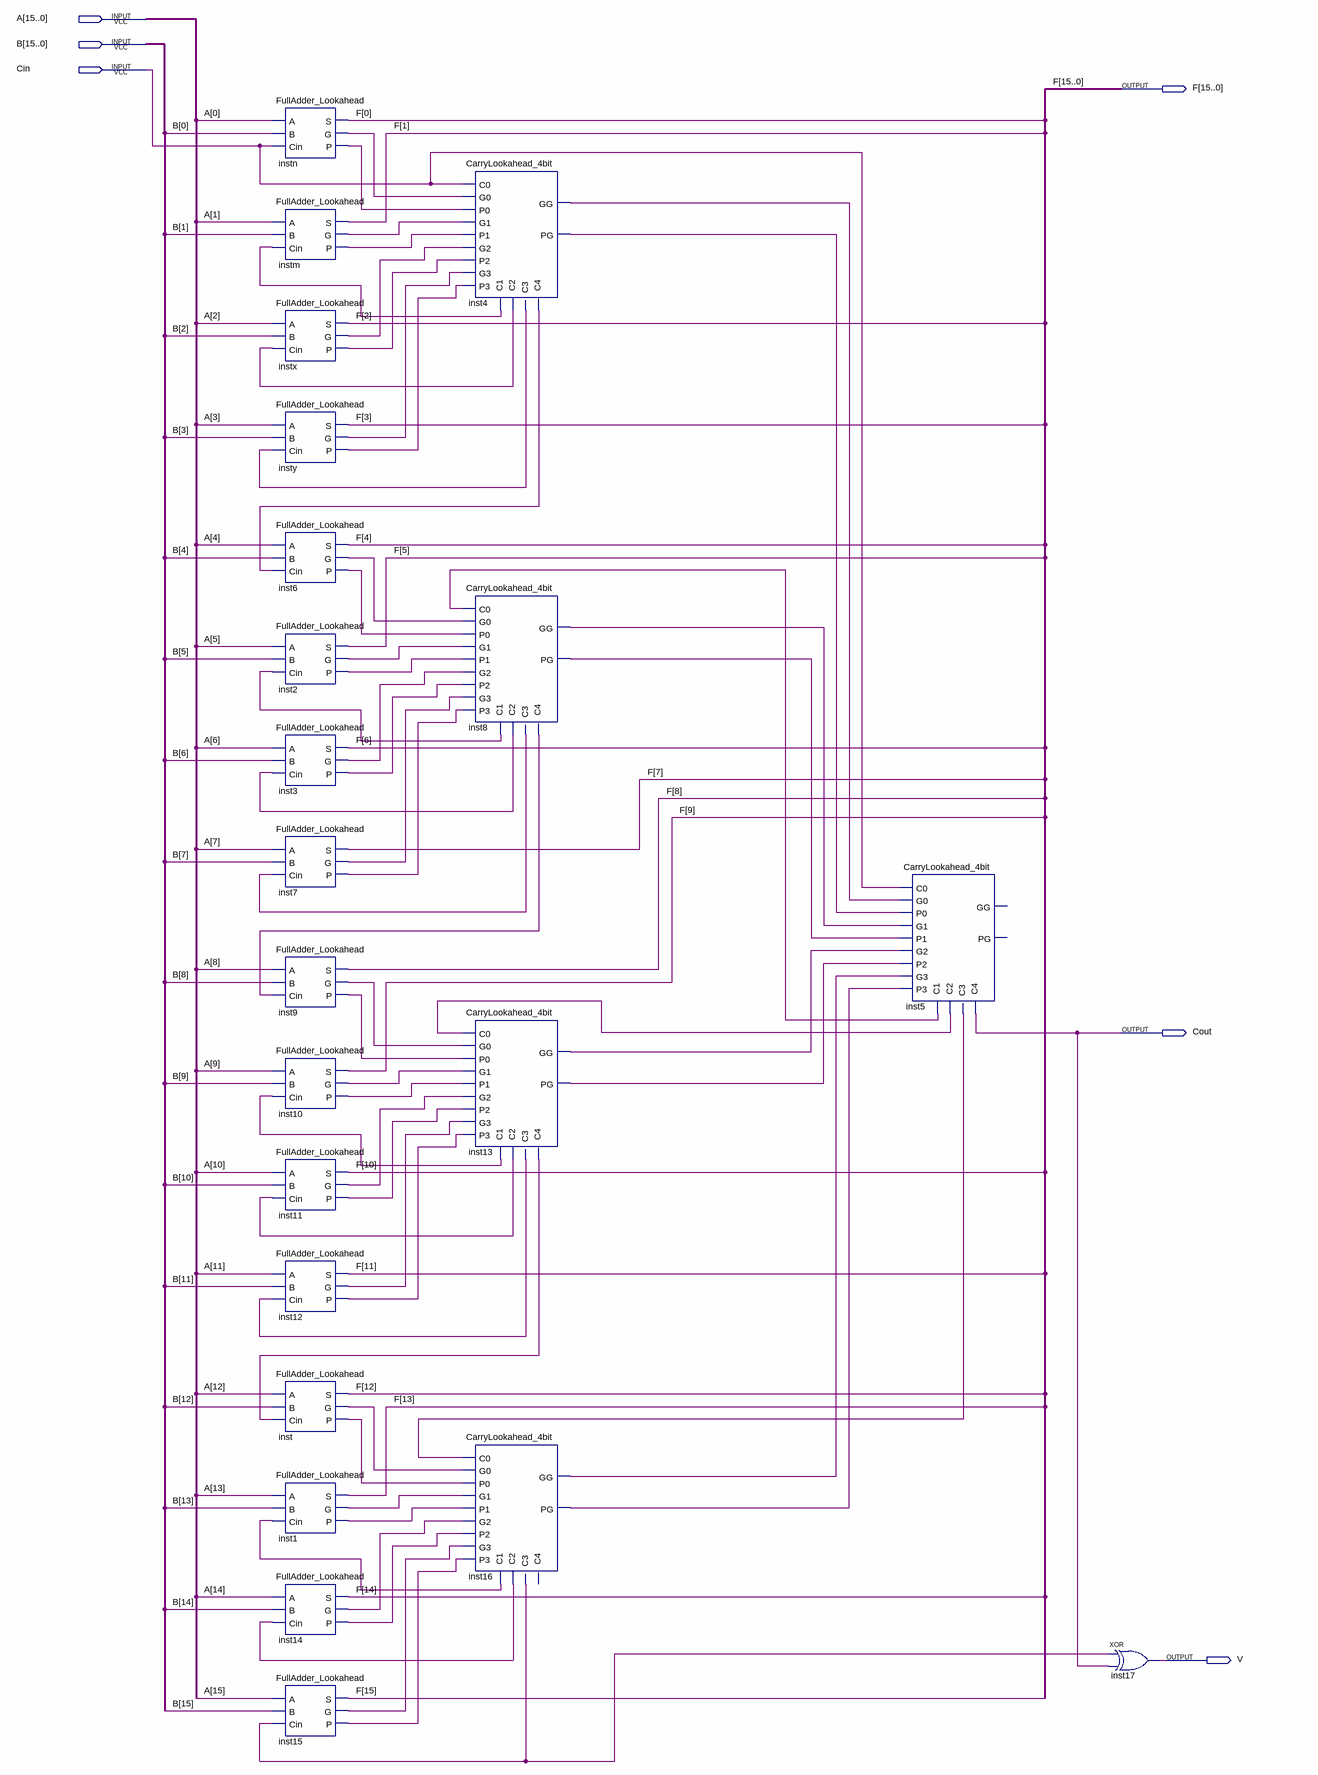
[diagram p0: schematic sheet]
// Quartus schematic 16_Bit_CarryLookahead_Adder.bdf as structural Verilog: 22 symbols, 6 pins
module \16_Bit_CarryLookahead_Adder  (
  input  [15:0] A,
  input  [15:0] B,
  input  Cin,
  output [15:0] F,
  output Cout,
  output V
);

  wire inst1_g, inst1_p, inst2_g, inst2_p, inst3_g, inst3_p, inst4_c1, inst4_c2, inst4_c3, inst4_c4,
       inst4_gg, inst4_pg, inst5_c1, inst5_c2, inst5_c3, inst6_g, inst6_p, inst7_g, inst7_p, inst8_c1,
       inst8_c2, inst8_c3, inst8_c4, inst8_gg, inst8_pg, inst9_g, inst9_p, inst10_g, inst10_p, inst11_g,
       inst11_p, inst12_g, inst12_p, inst13_c1, inst13_c2, inst13_c3, inst13_c4, inst13_gg, inst13_pg,
       inst14_g, inst14_p, inst15_g, inst15_p, inst16_c1, inst16_c2, inst16_c3, inst16_gg, inst16_pg, inst_g,
       inst_p, instm_g, instm_p, instn_g, instn_p, instx_g, instx_p, insty_g, insty_p;

  FullAdder_Lookahead instn (.A(A[0]), .B(B[0]), .Cin(Cin), .S(F[0]), .G(instn_g), .P(instn_p));
  FullAdder_Lookahead instm (.A(A[1]), .B(B[1]), .Cin(inst4_c1), .S(F[1]), .G(instm_g), .P(instm_p));
  FullAdder_Lookahead instx (.A(A[2]), .B(B[2]), .Cin(inst4_c2), .S(F[2]), .G(instx_g), .P(instx_p));
  FullAdder_Lookahead insty (.A(A[3]), .B(B[3]), .Cin(inst4_c3), .S(F[3]), .G(insty_g), .P(insty_p));
  FullAdder_Lookahead inst6 (.A(A[4]), .B(B[4]), .Cin(inst4_c4), .S(F[4]), .G(inst6_g), .P(inst6_p));
  FullAdder_Lookahead inst2 (.A(A[5]), .B(B[5]), .Cin(inst8_c1), .S(F[5]), .G(inst2_g), .P(inst2_p));
  FullAdder_Lookahead inst3 (.A(A[6]), .B(B[6]), .Cin(inst8_c2), .S(F[6]), .G(inst3_g), .P(inst3_p));
  FullAdder_Lookahead inst7 (.A(A[7]), .B(B[7]), .Cin(inst8_c3), .S(F[7]), .G(inst7_g), .P(inst7_p));
  FullAdder_Lookahead inst9 (.A(A[8]), .B(B[8]), .Cin(inst8_c4), .S(F[8]), .G(inst9_g), .P(inst9_p));
  FullAdder_Lookahead inst10 (.A(A[9]), .B(B[9]), .Cin(inst13_c1), .S(F[9]), .G(inst10_g), .P(inst10_p));
  FullAdder_Lookahead inst11 (.A(A[10]), .B(B[10]), .Cin(inst13_c2), .S(F[10]), .G(inst11_g), .P(inst11_p));
  FullAdder_Lookahead inst12 (.A(A[11]), .B(B[11]), .Cin(inst13_c3), .S(F[11]), .G(inst12_g), .P(inst12_p));
  FullAdder_Lookahead inst (.A(A[12]), .B(B[12]), .Cin(inst13_c4), .S(F[12]), .G(inst_g), .P(inst_p));
  FullAdder_Lookahead inst1 (.A(A[13]), .B(B[13]), .Cin(inst16_c1), .S(F[13]), .G(inst1_g), .P(inst1_p));
  FullAdder_Lookahead inst14 (.A(A[14]), .B(B[14]), .Cin(inst16_c2), .S(F[14]), .G(inst14_g), .P(inst14_p));
  FullAdder_Lookahead inst15 (.A(A[15]), .B(B[15]), .Cin(inst16_c3), .S(F[15]), .G(inst15_g), .P(inst15_p));
  CarryLookahead_4bit inst4 (
    .C0(Cin), .G0(instn_g), .P0(instn_p), .G1(instm_g), .P1(instm_p), .G2(instx_g), .P2(instx_p),
    .G3(insty_g), .P3(insty_p), .C1(inst4_c1), .C2(inst4_c2), .C3(inst4_c3), .C4(inst4_c4), .GG(inst4_gg),
    .PG(inst4_pg));
  CarryLookahead_4bit inst8 (
    .C0(inst5_c1), .G0(inst6_g), .P0(inst6_p), .G1(inst2_g), .P1(inst2_p), .G2(inst3_g), .P2(inst3_p),
    .G3(inst7_g), .P3(inst7_p), .C1(inst8_c1), .C2(inst8_c2), .C3(inst8_c3), .C4(inst8_c4), .GG(inst8_gg),
    .PG(inst8_pg));
  CarryLookahead_4bit inst13 (
    .C0(inst5_c2), .G0(inst9_g), .P0(inst9_p), .G1(inst10_g), .P1(inst10_p), .G2(inst11_g), .P2(inst11_p),
    .G3(inst12_g), .P3(inst12_p), .C1(inst13_c1), .C2(inst13_c2), .C3(inst13_c3), .C4(inst13_c4),
    .GG(inst13_gg), .PG(inst13_pg));
  CarryLookahead_4bit inst16 (
    .C0(inst5_c3), .G0(inst_g), .P0(inst_p), .G1(inst1_g), .P1(inst1_p), .G2(inst14_g), .P2(inst14_p),
    .G3(inst15_g), .P3(inst15_p), .C1(inst16_c1), .C2(inst16_c2), .C3(inst16_c3), .GG(inst16_gg),
    .PG(inst16_pg));  // open: C4
  CarryLookahead_4bit inst5 (
    .C0(Cin), .G0(inst4_gg), .P0(inst4_pg), .G1(inst8_gg), .P1(inst8_pg), .G2(inst13_gg), .P2(inst13_pg),
    .G3(inst16_gg), .P3(inst16_pg), .C1(inst5_c1), .C2(inst5_c2), .C3(inst5_c3), .C4(Cout));  // open: GG, PG
  xor inst17 (V, inst16_c3, Cout);
endmodule
